# Altium schematic sheet 04-4 m8 boot config.SchDoc
size A3; SheetNumber: 8; SheetTotal: 16
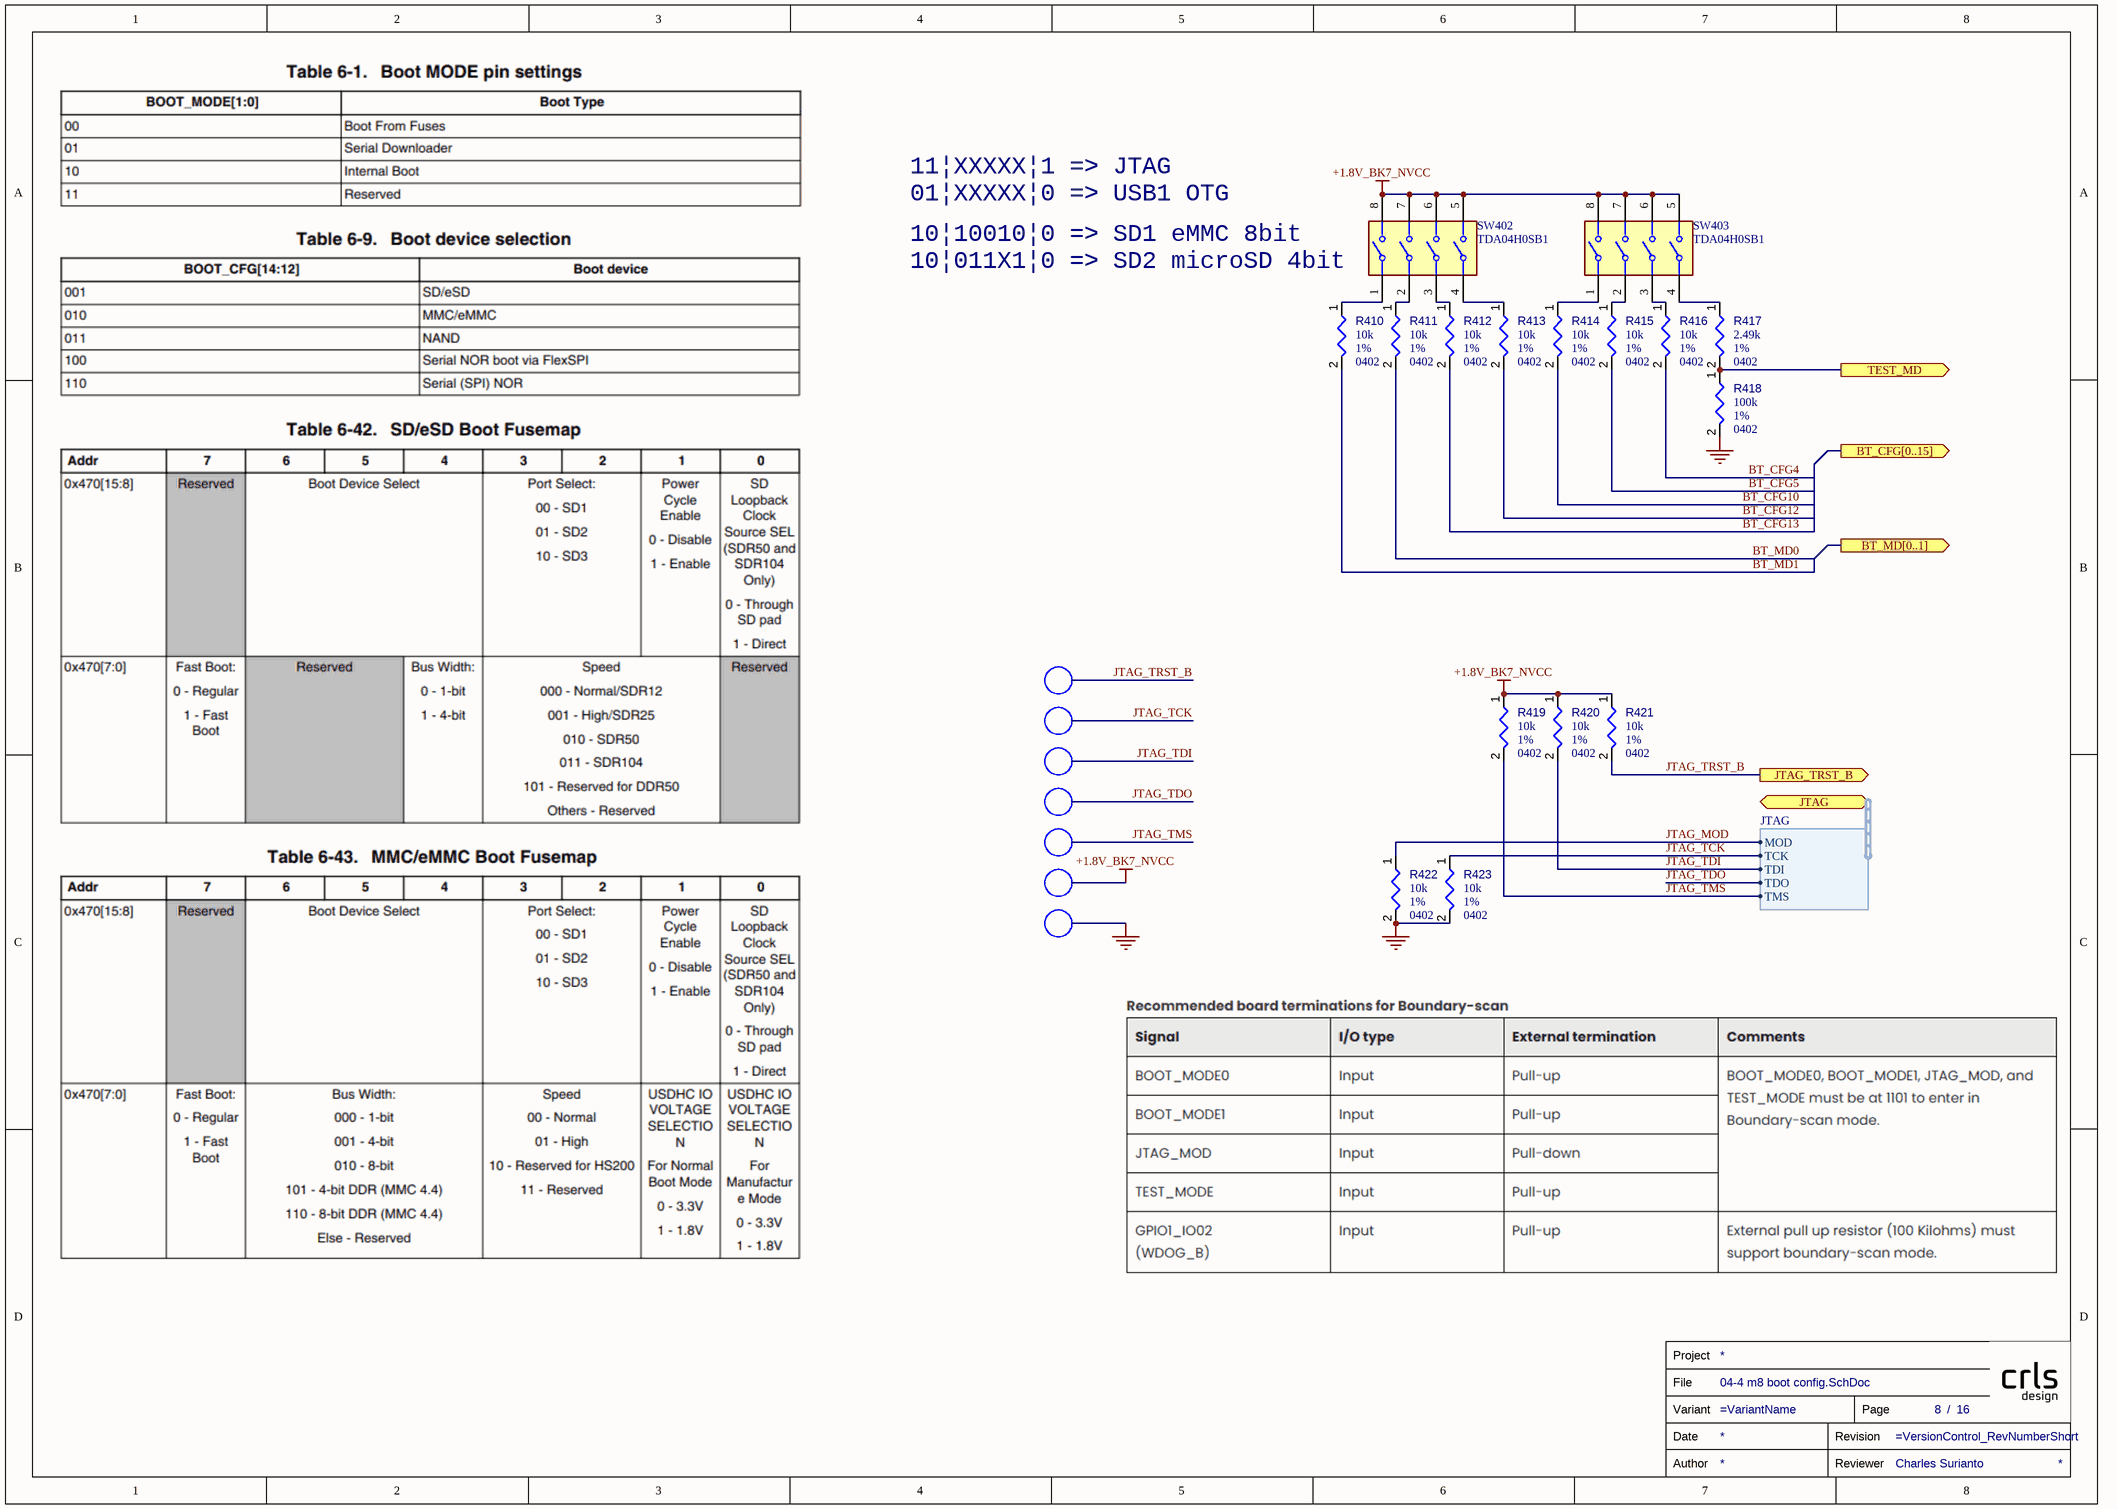
[diagram p0: 04-4 m8 boot config.SchDoc]

## Parts
R410  value 10k  Case/Package: 0402  Tolerance: 1%  [RESC0402(1005)_L]  (hidden comment: Resistors,0402,1%,10k)
R411  value 10k  Case/Package: 0402  Tolerance: 1%  [RESC0402(1005)_L]  (hidden comment: Resistors,0402,1%,10k)
R412  value 10k  Case/Package: 0402  Tolerance: 1%  [RESC0402(1005)_L]  (hidden comment: Resistors,0402,1%,10k)
R413  value 10k  Case/Package: 0402  Tolerance: 1%  [RESC0402(1005)_L]  (hidden comment: Resistors,0402,1%,10k)
R414  value 10k  Case/Package: 0402  Tolerance: 1%  [RESC0402(1005)_L]  (hidden comment: Resistors,0402,1%,10k)
R415  value 10k  Case/Package: 0402  Tolerance: 1%  [RESC0402(1005)_L]  (hidden comment: Resistors,0402,1%,10k)
R416  value 10k  Case/Package: 0402  Tolerance: 1%  [RESC0402(1005)_L]  (hidden comment: Resistors,0402,1%,10k)
R417  value 2.49k  Case/Package: 0402  Tolerance: 1%  [RESC0402(1005)_L]  (hidden comment: Resistors,0402,1%,2.49k)
R418  value 100k  Case/Package: 0402  Tolerance: 1%  [RESC0402(1005)_L]  (hidden comment: Resistors,0402,1%,100k)
R419  value 10k  Case/Package: 0402  Tolerance: 1%  [RESC0402(1005)_L]  (hidden comment: Resistors,0402,1%,10k)
R420  value 10k  Case/Package: 0402  Tolerance: 1%  [RESC0402(1005)_L]  (hidden comment: Resistors,0402,1%,10k)
R421  value 10k  Case/Package: 0402  Tolerance: 1%  [RESC0402(1005)_L]  (hidden comment: Resistors,0402,1%,10k)
R422  value 10k  Case/Package: 0402  Tolerance: 1%  [RESC0402(1005)_L]  (hidden comment: Resistors,0402,1%,10k)
R423  value 10k  Case/Package: 0402  Tolerance: 1%  [RESC0402(1005)_L]  (hidden comment: Resistors,0402,1%,10k)
SW402  TDA04H0SB1  [FP-TDA04H0SB1-MFG]
SW403  TDA04H0SB1  [FP-TDA04H0SB1-MFG]
TB?  Reviewer: Charles Surianto  (hidden comment: TITLE_BLOCK)  (graphical)

## Ports
BT_CFG[0..15] (out), BT_MD[0..1] (out), JTAG (bidir, harness JTAG), JTAG_TRST_B (out), TEST_MD (out)

## Harnesses
JTAG: MOD, TCK, TDI, TDO, TMS

## Nets
+1.8V_BK7_NVCC: R419.1 R420.1 R421.1 SW402.5 SW402.6 SW402.7 SW402.8 SW403.5 SW403.6 SW403.7 SW403.8
GND: R418.2 R422.2 R423.2
BT_CFG4: R416.2
BT_CFG5: R415.2
BT_CFG10: R414.2
BT_CFG12: R413.2
BT_CFG13: R412.2
BT_MD0: R411.2
BT_MD1: R410.2
JTAG_MOD: R422.1 ; port JTAG.MOD
JTAG_TCK: R423.1 ; port JTAG.TCK
JTAG_TDI: R420.2 ; port JTAG.TDI
JTAG_TDO: port JTAG.TDO
JTAG_TMS: R419.2 ; port JTAG.TMS
JTAG_TRST_B: R421.2 ; port JTAG_TRST_B
TEST_MD: R417.2 R418.1 ; port TEST_MD
NetR410_1: R410.1 SW402.1
NetR411_1: R411.1 SW402.2
NetR412_1: R412.1 SW402.3
NetR413_1: R413.1 SW402.4
NetR414_1: R414.1 SW403.1
NetR415_1: R415.1 SW403.2
NetR416_1: R416.1 SW403.3
NetR417_1: R417.1 SW403.4

## Notes on the sheet
- 11|XXXXX|1 => JTAG
- 01|XXXXX|0 => USB1 OTG
- 10|10010|0 => SD1 eMMC 8bit
- 10|011X1|0 => SD2 microSD 4bit
- (in symbol TITLE_BLOCK) Project; File; Variant; Page; /; Date; Revision; Author; Reviewer

## Library data of the parts
R410-R423 = Resistors: Resistor; Component Type: Resistors
SW402 SW403 = CMP-10033-000006-1: SWITCH SLIDE DIP SPST 25MA 24V; Number of Switches: 4; Body Material: Polyphenylene; Pitch: 0.05inch; Washable: Yes; Lead/Base Style: Gull Wing; Electrical Life: 1000Cycles; Actuator Material: Polymer; Actuator Type: Slide (Standard); Contact Resistance: 100mR; Actuator Length: 0mm; Current Rating: 100mA; Number of Positions: 4; Reach SVHC Compliant: Yes; Throw Configuration: SPST; Orientation: Straight; Lead Free: Lead Free; Max Current Rating: 25mA; Length: 6.21mm; Packaging: Rail/Tube; Terminal Pitch: 1.27mm; Max Voltage Rating (DC): 24V; Case/Package: DIP; Depth: 8.12mm; Termination: Gull Wing; Contact Plating: Gold; Contact Material: Copper Alloy; Contact Current Rating: 25mA; Voltage Rating (DC): 24V; Max Operating Temperature: 85°C; Package Quantity: 70; Mount: Surface Mount; RoHS Compliant: Yes; Mechanical Life: 1000Cycles; Radiation Hardening: No; Series: TDA; Min Operating Temperature: -40°C
TB? = TITLE_BLOCK: Review Date: *